# Altium schematic sheet CounterMIN.SchDoc
size A4; SheetNumber: 12; SheetTotal: 12
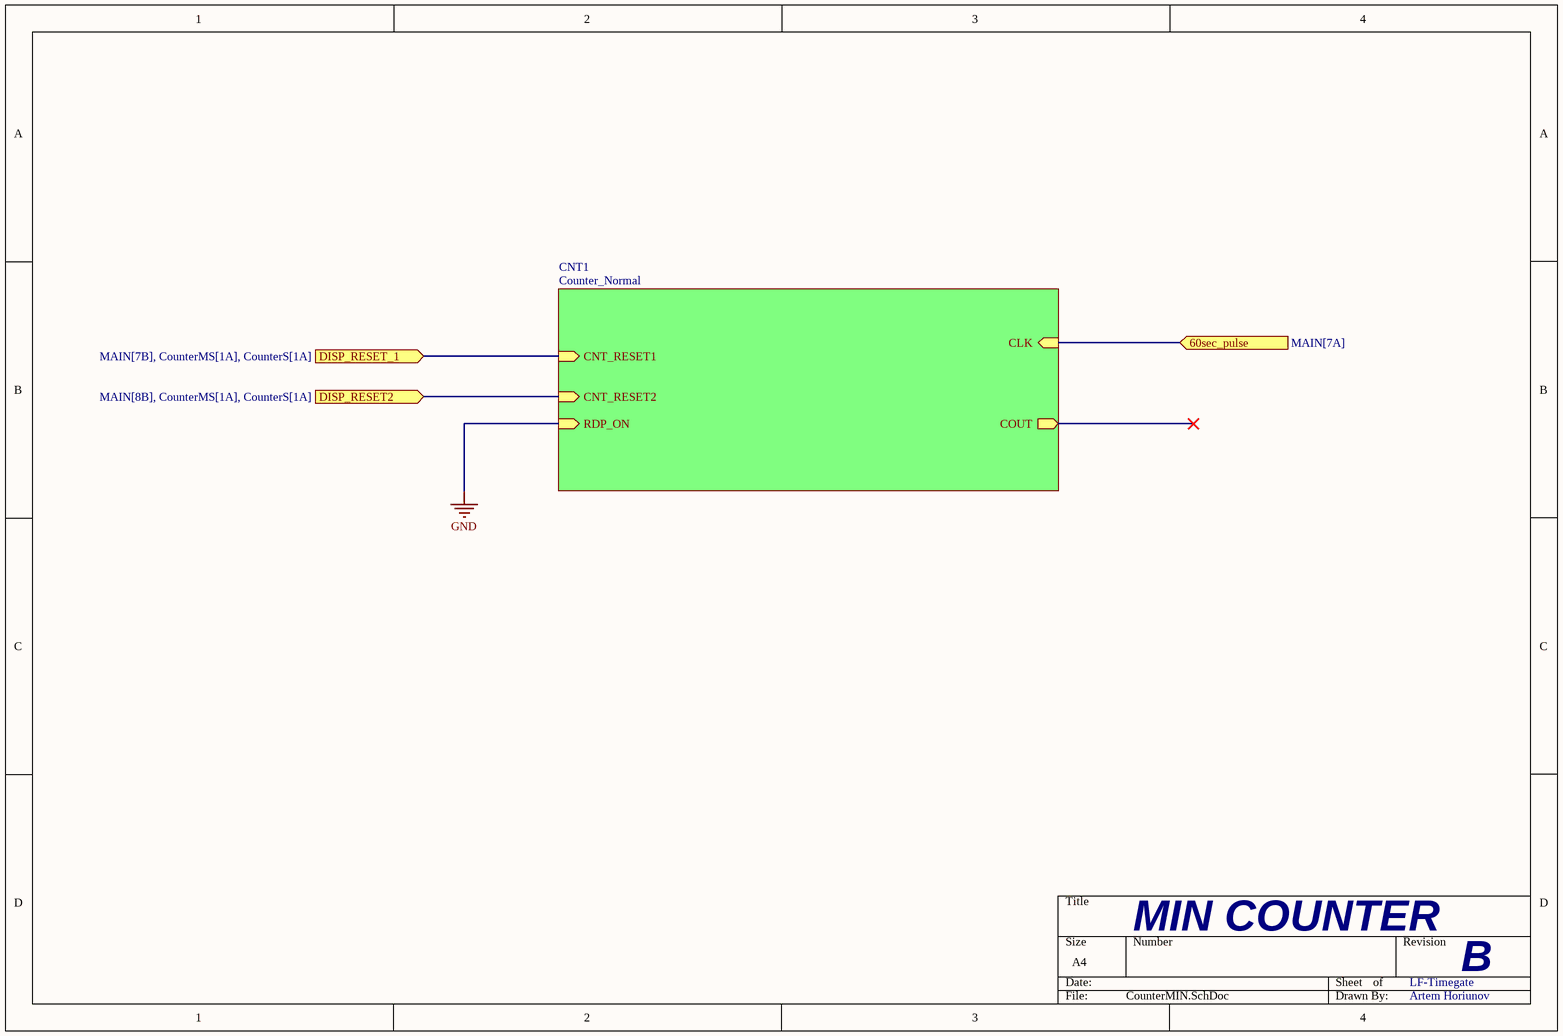
[diagram p0: CounterMIN.SchDoc]

## Sub-sheets
CNT1 = Counter_Normal: COUT (out), CNT_RESET1 (in), CNT_RESET2 (in), CLK (in), RDP_ON (in)

## Ports
60sec_pulse (in, see MAIN[7A]), DISP_RESET2 (in, see MAIN[8B], CounterMS[1A], CounterS[1A]), DISP_RESET_1 (in, see MAIN[7B], CounterMS[1A], CounterS[1A])

## Nets
GND: sheet CNT1/RDP_ON
60sec_pulse: port 60sec_pulse, sheet CNT1/CLK
DISP_RESET2: port DISP_RESET2, sheet CNT1/CNT_RESET2
DISP_RESET_1: port DISP_RESET_1, sheet CNT1/CNT_RESET1

## Notes on the sheet
- MIN COUNTER
- LF-Timegate
- B
- Artem Horiunov